# Altium schematic sheet CAN.SchDoc
size A4; SheetNumber: 2; SheetTotal: 2
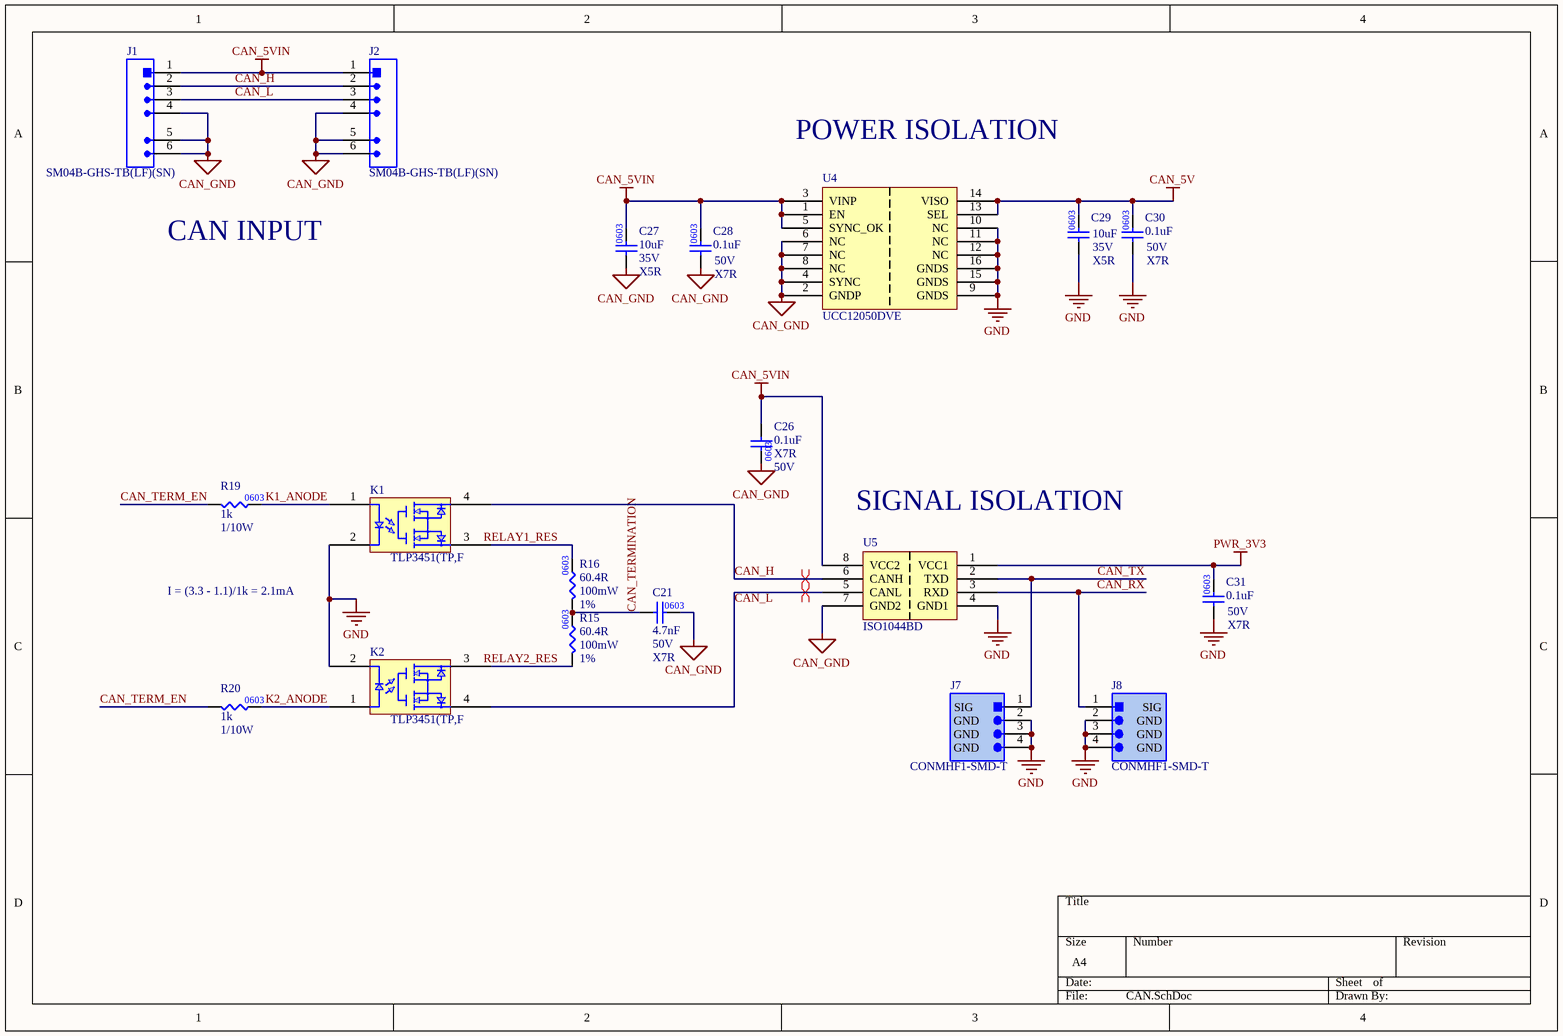
[diagram p0: CAN.SchDoc]

## Parts
C21  value 4.7nF  Rated DC Voltage (URdc): 50V  Temperature Characteristics Code: X7R  [.CAP_0603-Footprint-1]  (hidden comment: GCM188R71H472KA37D)
C26  value 0.1uF  Dielectric: X7R  Voltage: 50V  [.CAP_0603-Footprint-1]  (hidden comment: GCM188R71H104KA57D)
C27  Capacitance: 10uF  Voltage: 35V  Temperature Coefficient: X5R  [.CAP_0603-Footprint-1]  (hidden comment: GRM188R6YA106MA73D)
C28  value 0.1uF  Dielectric: X7R  Voltage: 50V  [.CAP_0603-Footprint-1]  (hidden comment: GCM188R71H104KA57D)
C29  Capacitance: 10uF  Voltage: 35V  Temperature Coefficient: X5R  [.CAP_0603-Footprint-1]  (hidden comment: GRM188R6YA106MA73D)
C30  value 0.1uF  Dielectric: X7R  Voltage: 50V  [.CAP_0603-Footprint-1]  (hidden comment: GCM188R71H104KA57D)
C31  value 0.1uF  Dielectric: X7R  Voltage: 50V  [.CAP_0603-Footprint-1]  (hidden comment: GCM188R71H104KA57D)
J1  SM04B-GHS-TB(LF)(SN)  [CONN_SM04B-GHS-TB_JST]
J2  SM04B-GHS-TB(LF)(SN)  [CONN_SM04B-GHS-TB_JST]
J7  CONMHF1-SMD-T  [CONMHF1-SMD-T-Footprint-1]
J8  CONMHF1-SMD-T  [CONMHF1-SMD-T-Footprint-1]
K1  TLP3451(TP,F  [TLP3451(TP,F-Footprint-1]
K2  TLP3451(TP,F  [TLP3451(TP,F-Footprint-1]
R15  value 60.4R  Tolerance: 1%  Power: 100mW  [RES0603]  (hidden comment: RC0603FR-1360R4L)
R16  value 60.4R  Tolerance: 1%  Power: 100mW  [RES0603]  (hidden comment: RC0603FR-1360R4L)
R19  value 1k  Power: 1/10W  [.RES_0603-Footprint-1]  (hidden comment: RC0603FR-071KL)
R20  value 1k  Power: 1/10W  [.RES_0603-Footprint-1]  (hidden comment: RC0603FR-071KL)
U4  UCC12050DVE  [16SOIC-Footprint]
U5  ISO1044BD  [8SOIC-Footprint-1]

## Nets
CAN_5V: C29.2 C30.2 U4.13(SEL) U4.14(VISO)
CAN_5VIN: C26.2 C27.2 C28.2 J1.1 J2.1 U4.1(EN) U4.3(VINP) U4.5(SYNC_OK) U5.8(VCC2)
CAN_GND: C21.2 C26.1 C27.1 C28.1 J1.4 J1.5 J1.6 J2.4 J2.5 J2.6 U4.2(GNDP) U4.4(SYNC) U4.6(NC) U4.7(NC) U4.8(NC) U5.7(GND2)
GND: C29.1 C30.1 C31.1 J7.2(GND) J7.3(GND) J7.4(GND) J8.2(GND) J8.3(GND) J8.4(GND) K1.2(Cathode) K2.2(Cathode) U4.9(GNDS) U4.10(NC) U4.11(NC) U4.12(NC) U4.15(GNDS) U4.16(GNDS) U5.4(GND1)
PWR_3V3: C31.2 U5.1(VCC1)
CAN_H: J1.2 J2.2 K1.4(Drain) U5.6(CANH)
CAN_L: J1.3 J2.3 K2.4(Drain) U5.5(CANL)
CAN_RX: J8.1(SIG) U5.3(RXD)
CAN_TERM_EN: R19.1 R20.1
CAN_TERMINATION: C21.1 R15.2 R16.1
CAN_TX: J7.1(SIG) U5.2(TXD)
K1_ANODE: K1.1(Anode) R19.2
K2_ANODE: K2.1(Anode) R20.2
RELAY1_RES: K1.3(Drain) R16.2
RELAY2_RES: K2.3(Drain) R15.1

## Layout directives
differential pair: CAN_H, CAN_L

## Notes on the sheet
- POWER ISOLATION
- CAN INPUT
- (near U5) SIGNAL ISOLATION
- I = (3.3 - 1.1)/1k = 2.1mA
- (in symbol CMP-00245-1) 0603
- (in symbol CMP-00449-4) 0603

## Library data of the parts
C21 = CMP-001-00080-1: CAP CER 4700PF 50V X7R 0603; Tolerance (fill in as +-): 10%; Multilayer: Yes; Capacitor Type: Ceramic; Reference Standard: AEC-Q200; Pins: 2; Package Shape: Rectangular; Reach SVHC Compliant: Yes; RoHS Compliant: Yes; Height: 0.9mm; Terminal Finish: Nickel; Termination: Wraparound; Width: 0.8mm; Mounting Technology: Surface Mount; JESD-609 Code: e3; Package Style: SMTMeter; Length: 1.6mm; Packaging: Tape and Reel; Tolerance  (fill in as +-): 10%; Case/Package: 0603; Max Operating Temperature: 125°C; Min Operating Temperature: -55°C; Dielectric Material: Ceramic
C26 C28 C30 C31 = CMP-00047-4: CAP CER 0.1uF 50V X7R 0603; Tolerance: 10%; Capacitance: 100nF; Case Code (Imperial): 0603; Mount: Surface Mount
C27 C29 = CMP-00449-4: CAP CER 10UF 35V X5R 0603; Tolerance: ±20%
J1 J2 = CMP-068-000000-6: Conn Shrouded Header HDR 4 POS 1.25mm Solder RA SMD Reel; Entry Type: R/A; Series: JST-GH; Pins: 4
J7 J8 = CMP-00321-7: CONN UMC JACK STR SMD; Max Frequency: 6GHz; Impedance: 50Ω; Voltage Rating: 60V; Mounting Type: Surface Mount
K1 K2 = CMP-00646-3: Solid State Relay 20MA 1.4V Dc-in Ac/dc-out 4-PIN Vson T/r
R15 R16 = CMP-00245-1: RES 60.4 OHM 1% 1/10W 0603
R19 R20 = CMP-009-00012-4: RES 1k OHM 1% 1/10W 0603; Tolerance: 1%; Package: 0603
U4 = CMP-147-000011-2: DC DC CONVERTER 3.3V 5V 500MW; ComponentLink3Description: Package Specification; ComponentLink2Description: Manufacturer URL; ComponentLink1Description: Datasheet
U5 = CMP-147-000015-1: Isolated CAN FD transceiver in small package 8-SOIC -40 to 125; Min Supply Voltage: 1.71V; Max Supply Voltage: 5.5V; ComponentLink1Description: Datasheet; Max Operating Temperature: 125°C; ComponentLink2Description: Manufacturer URL; Case/Package: SOIC; ComponentLink3Description: Package Specification